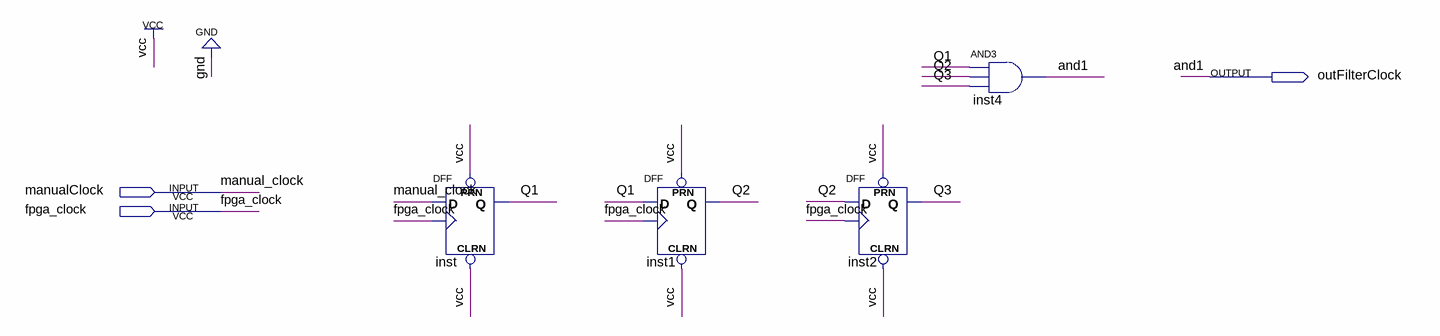
[diagram p0: schematic sheet]
// Quartus schematic digital_filter.bdf as structural Verilog: 4 symbols, 3 pins
module digital_filter (
  input  manualClock,
  input  fpga_clock,
  output outFilterClock
);

  wire Q1, Q2, Q3;

  DFF inst (.CLRN(1'b1), .CLK(fpga_clock), .D(manualClock), .PRN(1'b1), .Q(Q1));
  DFF inst1 (.CLRN(1'b1), .CLK(fpga_clock), .D(Q1), .PRN(1'b1), .Q(Q2));
  DFF inst2 (.CLRN(1'b1), .CLK(fpga_clock), .D(Q2), .PRN(1'b1), .Q(Q3));
  and inst4 (outFilterClock, Q1, Q2, Q3);

  // Other names for the same wires on the sheet: and1 = outFilterClock; manual_clock = manualClock
endmodule
